# EAGLE design xiao-grove-shield (EAGLE 9.3.1)
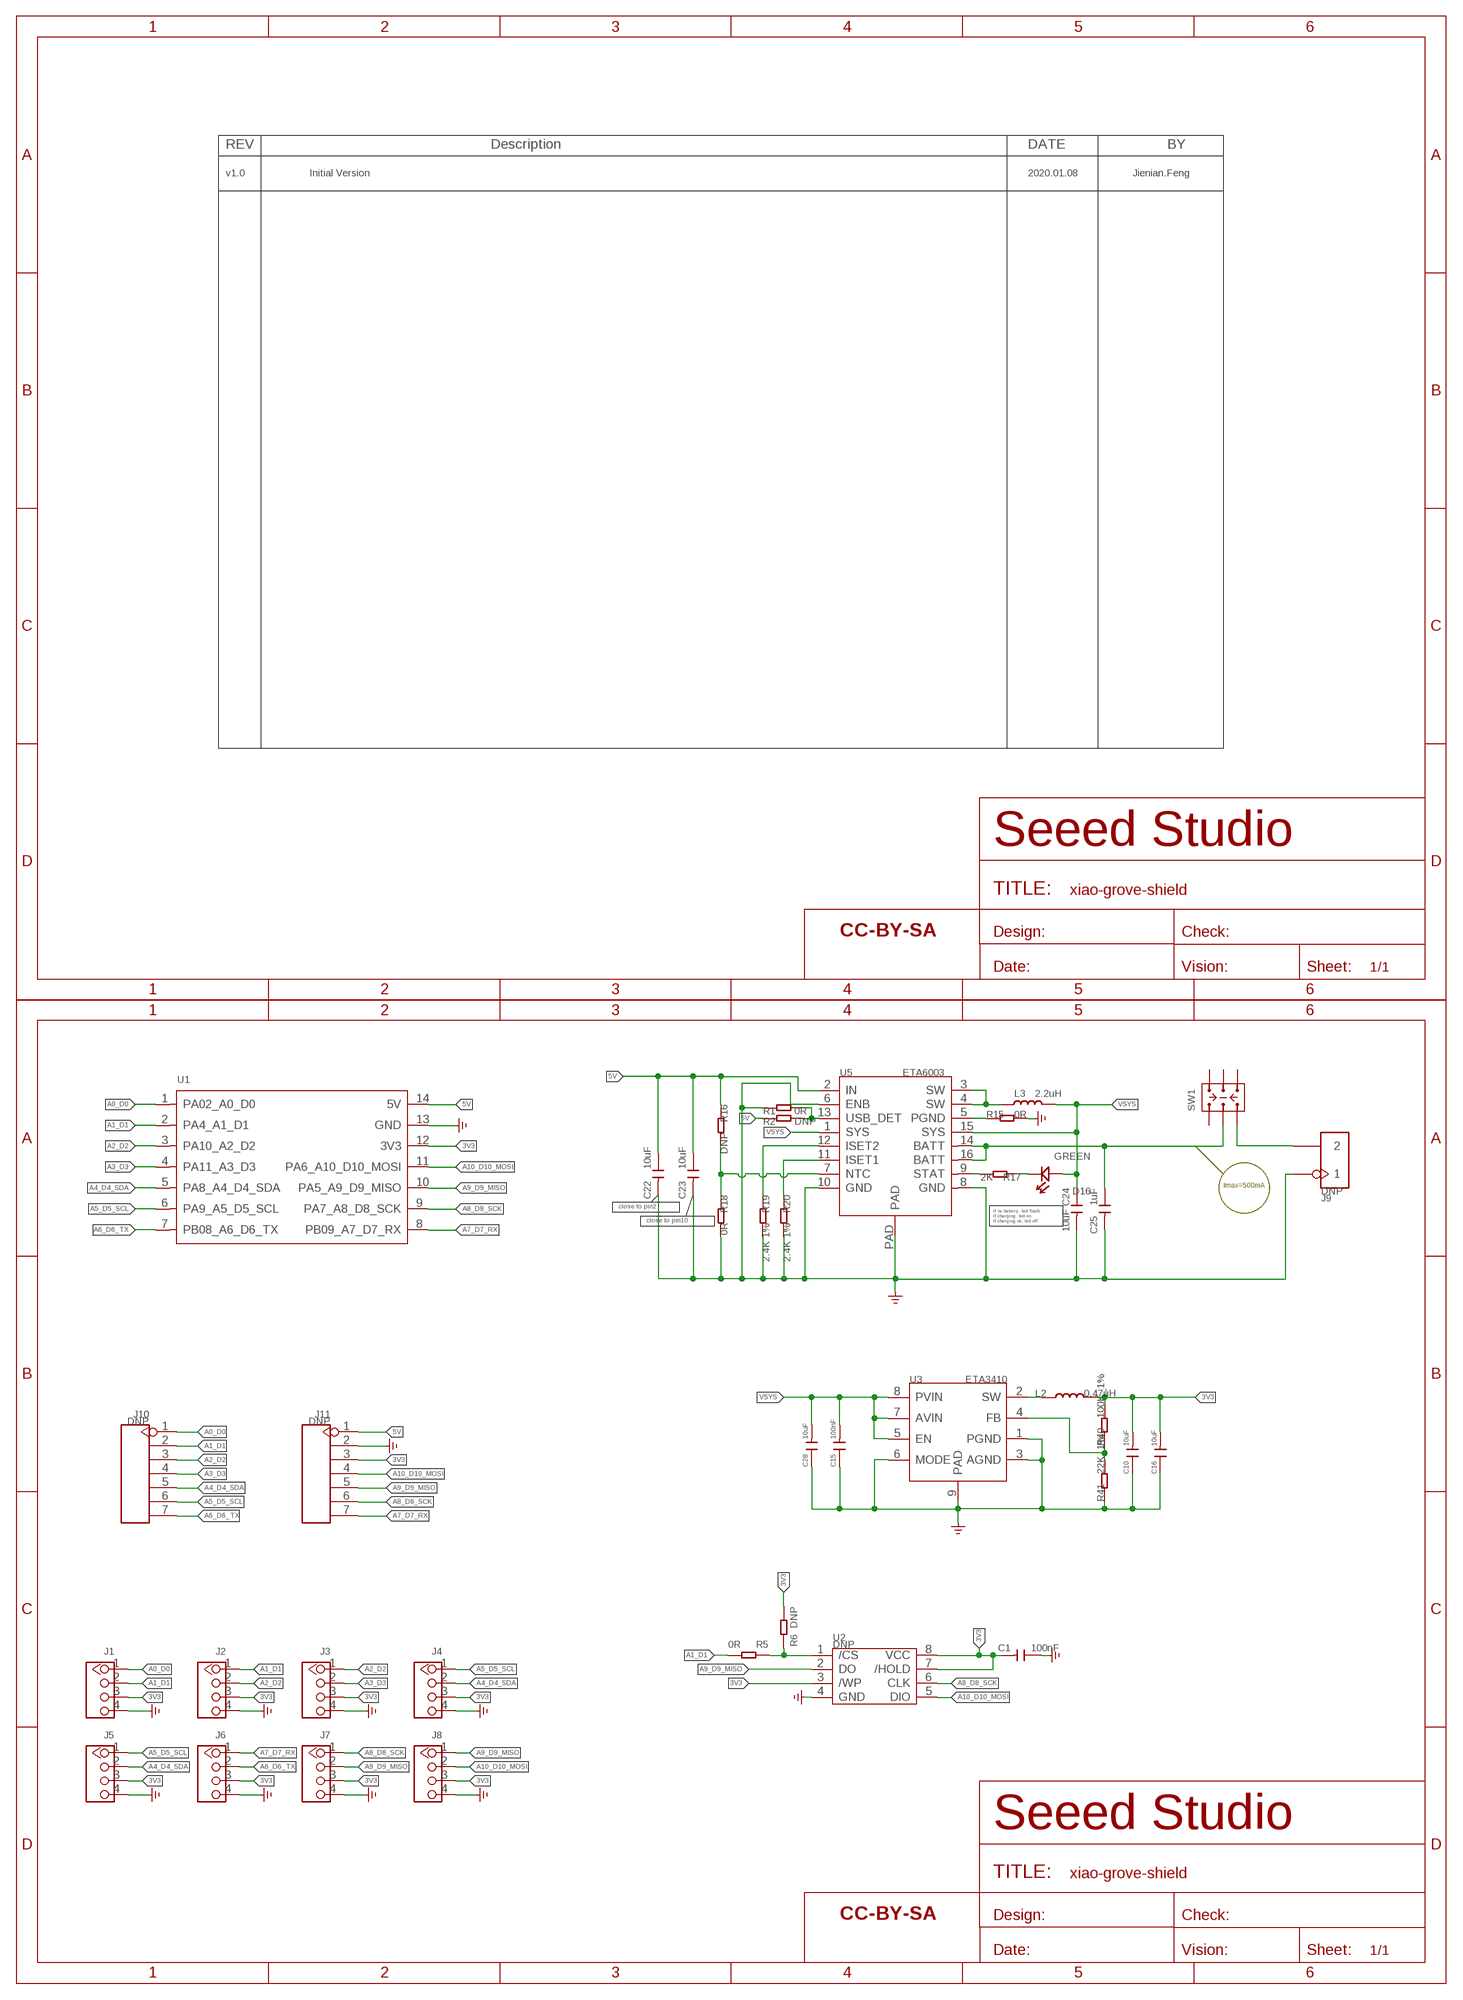
[diagram p0: schematic, sheet 1]

## Parts
C1  100nF  CAP-0402  [C0402]
C10  10uF  CAP-0603  [C0603]
C15  100nF  C-0402  [C0402]
C16  10uF  CAP-0603  [C0603]
C22  10uF  CAP-0603  [C0603]
C23  10uF  CAP-0603  [C0603]
C24  10uF  CAP-0603  [C0603]
C25  1uF  C-0402  [C0402]
C28  10uF  CAP-0603  [C0603]
D16  GREEN  LED-0402  [LED-0402]
FR1  SEEEDSTUDIO-OPEN-SCH-FRAME  [SEEEDSTUDIO-PCB-FRAME]
FR2  SEEEDSTUDIO-OPEN-SCH-FRAME  [SEEEDSTUDIO-PCB-FRAME]
J1  GROVE-CONNECTOR-DIP-320110033  [HW4-2.0]
J2  GROVE-CONNECTOR-DIP-320110033  [HW4-2.0]
J3  GROVE-CONNECTOR-DIP-320110033  [HW4-2.0]
J4  GROVE-CONNECTOR-DIP-320110033  [HW4-2.0]
J5  GROVE-CONNECTOR-DIP-320110033  [HW4-2.0]
J6  GROVE-CONNECTOR-DIP-320110033  [HW4-2.0]
J7  GROVE-CONNECTOR-DIP-320110033  [HW4-2.0]
J8  GROVE-CONNECTOR-DIP-320110033  [HW4-2.0]
J9  DNP  HEADER-2P-50/30MIL  [H2-2.0-C50D30MIL]
J10  DNP  HEADER-7P-2.54  [H7-2.54]
J11  DNP  HEADER-7P-2.54  [H7-2.54]
L2  0.47uH  L-MPM201610SR33_T  [L201610]
L3  2.2uH  INDUCTOR/FERRITE-BEAD'0805'  [L0805]
R1  0R  RES-0402  [R0402]
R2  DNP  RES-0402  [R0402]
R5  0R  RES-0402  [R0402]
R6  DNP  RES-0402  [R0402]
R15  0R  R-0402  [R0402]
R16  DNP  R-0402  [R0402]
R17  2K  R-0402  [R0402]
R18  0R  R-0402  [R0402]
R19  2.4K 1%  R-0402  [R0402]
R20  2.4K 1%  R-0402  [R0402]
R40  100K_1%  R-0402  [R0402]
R41  22K_1%  R-0402  [R0402]
SW1  SWITCH-2CH-6P-311030004  [SW6-2.54-9.0X3.5X3.2MM-90D]
U1  MOUDLE-SEEEDUINO-XIAO-DIP  [MOUDLE14P-2.54-21X17.8MM]
U2  DNP  FLASH-W25X80-SS  [SOIC8-1.27-5.3X5.3MM]
U3  ETA3410  CONVERTER-ETA3410  [DFN8G-0.5-2X2MM]
U5  ETA6003  PMIC-ETA6003-310990023  [QFN16GA-0.5-3X3MM]

## Nets
3V3: C1.2 C10.2 C16.2 J1.3 J2.3 J3.3 J4.3 J5.3 J6.3 J7.3 J8.3 J11.3 L2.2 R6.1 R40.2 U1.12(3V3) U2.3(/WP) U2.7(/HOLD) U2.8(VCC)
5V: C22.1 C23.1 J11.1 R2.1 R16.1 U1.14(5V) U5.2(IN)
A0_D0: J1.1 J10.1 U1.1(PA02_A0_D0)
A1_D1: J1.2 J2.1 J10.2 R5.1 U1.2(PA4_A1_D1)
A2_D2: J2.2 J3.1 J10.3 U1.3(PA10_A2_D2)
A3_D3: J3.2 J10.4 U1.4(PA11_A3_D3)
A4_D4_SDA: J4.2 J5.2 J10.5 U1.5(PA8_A4_D4_SDA)
A5_D5_SCL: J4.1 J5.1 J10.6 U1.6(PA9_A5_D5_SCL)
A6_D6_TX: J6.2 J10.7 U1.7(PB08_A6_D6_TX)
A7_D7_RX: J6.1 J11.7 U1.8(PB09_A7_D7_RX)
A8_D8_SCK: J7.1 J11.6 U1.9(PA7_A8_D8_SCK) U2.6(CLK)
A9_D9_MISO: J7.2 J8.1 J11.5 U1.10(PA5_A9_D9_MISO) U2.2(DO)
A10_D10_MOSI: J8.2 J11.4 U1.11(PA6_A10_D10_MOSI) U2.5(DIO)
GND: C1.1 C10.1 C15.1 C16.1 C22.2 C23.2 C24.2 C25.2 C28.1 J1.4 J2.4 J3.4 J4.4 J5.4 J6.4 J7.4 J8.4 J9.1 J11.2 R1.1 R15.2 R18.2 R19.2 R20.2 R41.1 U1.13(GND) U2.4(GND) U3.1(PGND) U3.3(AGND) U3.6(MODE) U3.9(PAD) U5.6(ENB) U5.8(GND) U5.10(GND) U5.PAD ; supply symbol labelled GND_POWER
N$1: R1.2 R2.2 U5.13(USB_DET)
N$2: J9.2 SW1.CH1B
N$3: R5.2 R6.2 U2.1(/CS)
N$4: C25.1 SW1.COM1 U5.14(BATT) U5.16(BATT)
N$21: R40.1 R41.2 U3.4(FB)
N$26: L3.1 U5.3(SW) U5.4(SW)
N$29: L2.1 U3.2(SW)
N$30: D16.- R17.1
N$31: R17.2 U5.9(STAT)
N$33: R16.2 R18.1 U5.7(NTC)
N$34: R20.1 U5.11(ISET1)
N$36: R19.1 U5.12(ISET2)
N$37: R15.1 U5.5(PGND)
VSYS: C15.2 C24.1 C28.2 D16.+ L3.2 U3.5(EN) U3.7(AVIN) U3.8(PVIN) U5.1(SYS) U5.15(SYS)
Unconnected: SW1.CH1A SW1.CH2A SW1.CH2B SW1.COM2

## Notes on the sheet
- v1.0 | Initial Version | 2020.01.08 | Jienian.Feng
- Imax=500mA
- close to pin2
- close to pin10
- if no battery, led flash.
  if charging, led on.
  if charging ok, led off.

## Library data of the parts
C1 C10 C16 C22-C24 C28 = Discrete-new:CAP: Ceramic Capacitors
C15 C25 = Discrete-small:C*: Ceramic Capacitors
D16 = Discrete-new:LED
FR1 FR2 = moudle-new:SEEEDSTUDIO-OPEN-SCH-FRAME
J1-J8 = Connector-new:GROVE-CONNECTOR-DIP
J9 = Connector-new:HEADER-2P
J10 J11 = Connector-new:HEADER-7P
L2 = Discrete-new:L
L3 = Discrete-new:INDUCTOR/FERRITE-BEAD
R1 R2 R5 R6 = Discrete-new:RES
R15-R20 R40 R41 = Discrete-small:R*
SW1 = Switch:SWITCH-2CH-6P
U1 = moudle-new:MOUDLE-SEEEDUINO-XIAO
U2 = IC-new:FLASH-W25X80: 1M-BIT,2M-BIT,4M-BIT AND 8M-BIT SERIAL FLASH MEMORY WITH 4KB SECTORS AND DUAL OUTPUT SPI
U3 = IC-new:CONVERTER-ETA3410: 3MHZ 2A High Step-Down Converter in DFN2x2-8L Package
U5 = IC-new:PMIC-ETA6003

## Board
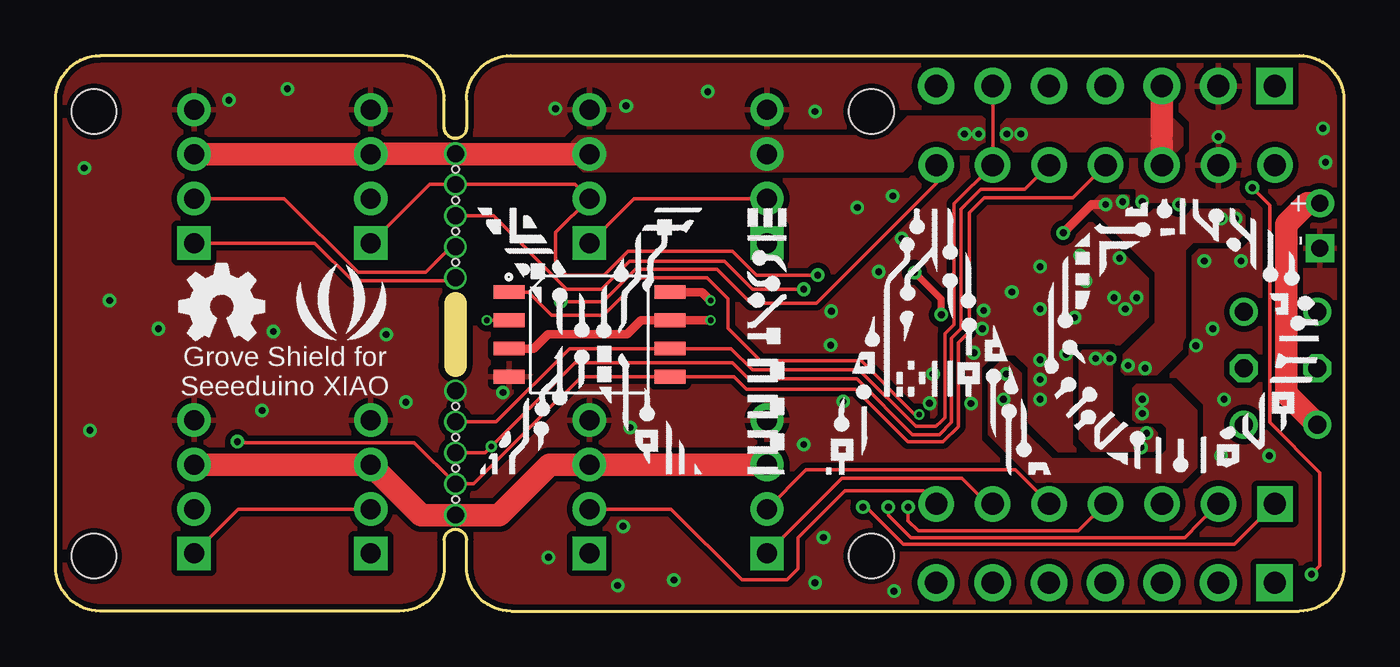
[diagram p1: board, top side]
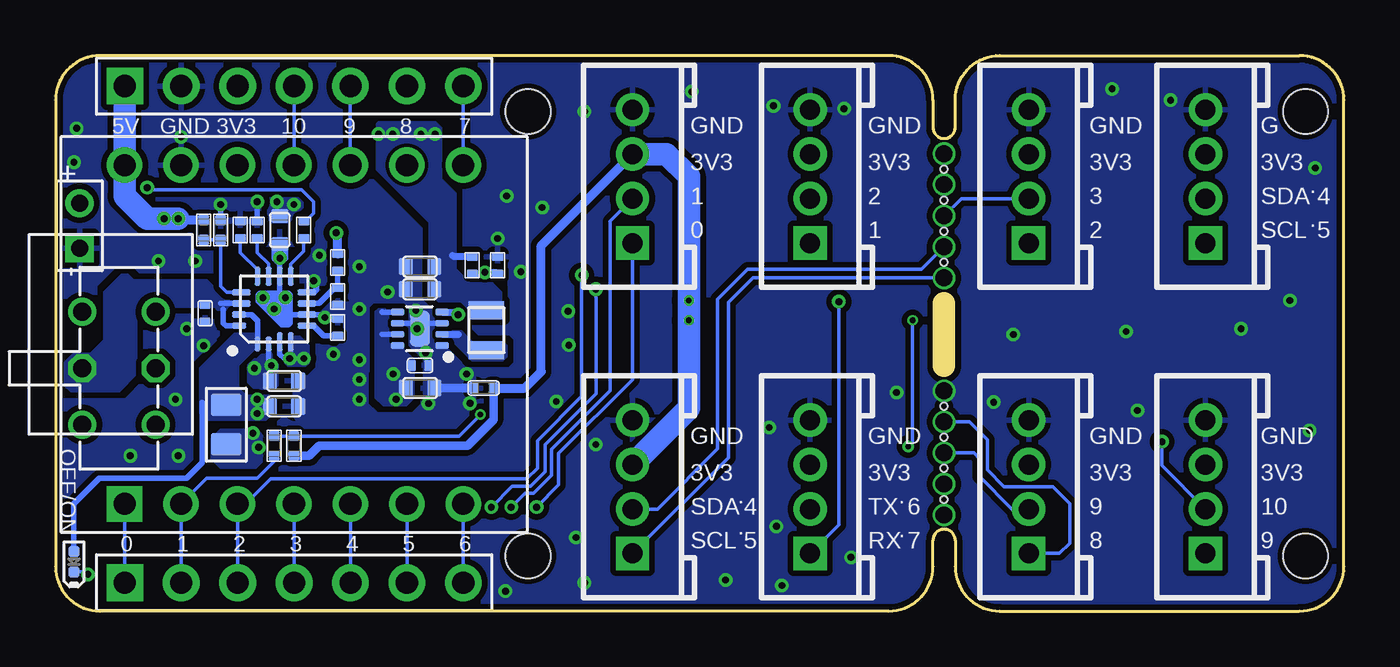
[diagram p2: board, bottom side, seen from below]

Size 58 x 25 mm. Coordinates in mm from the lower left corner, seen from the top.
Outline: 18,13.85 18,11.04
Outline: 18.5,2 18.5,3.19 arc180 17.5,3.19 17.5,2 arc-90 15.5,0 2,0 arc-90 0,2 0,23 arc-90 2,25 15.5,25 arc-90 17.5,23 17.5,21.77 arc180 18.5,21.77 18.5,23 arc-90 20.5,25 56,25 arc-90 58,23 58,2 arc-90 56,0 20.5,0 arc-90 18.5,2
Copper layers (1*16): Top 0.035mm / dielectric 1.5mm / Bottom 0.035mm
Design rules "SeeedStudio_2layer_DRU_no_angle_20140221 *": minimum track width 1mil, minimum drill 10mil, track to track 6mil, track to pad 6mil, pad to pad 6mil, via to via 6mil, smd to smd 0mil, copper to edge 10mil, drill to drill 10mil, minimum pad ring 2mil, minimum via ring 2mil, stop-mask expansion 2mil, vias tented up to drill 25mil, thermal gap 10mil
Holes 2 mm at 1.73,22.48 1.73,2.49 36.73,22.48 36.73,2.49
Holes 0.3 mm at 18,19.88 18,18.48 18,17.09 18,15.69 18,9.21 18,7.82 18,6.42 18,5.02
bRestrict: area 36,12.6 to 36.1,13.2

### Footprints (pad centres in the part's own frame; a part is rotated, then mirrored left to right if it is on the bottom)
C0402 = smd 0.445 x 0.508: 1 -0.445,0; 2 0.445,0
C0603 = smd 0.635 x 0.762: 1 -0.635,0; 2 0.635,0
C0402' = smd 0.385 x 0.508: 1 0.383,0; 2 -0.383,0
LED-0402 = smd 0.5 x 0.5: + 0.463,0; - -0.463,0
HW4-2.0 = drill 0.9 pad 1.5 square: 1 -3,0 | drill 0.9 pad 1.5: 2 -1,0; 3 1,0; 4 3,0
H2-2.0-C50D30MIL = drill 0.762 pad 1.27 square: 1 -1.016,0 | drill 0.762 pad 1.27: 2 1.016,0
H7-2.54 = drill 1 pad 1.651 square: 1 0,7.62 | drill 1 pad 1.651: 2 0,5.08; 3 0,2.54; 4 0,0; 5 0,-2.54; 6 0,-5.08; 7 0,-7.62
L201610 = smd 0.8 x 1.6: 1 -0.9,0; 2 0.9,0
L0805 = smd 1.016 x 1.397: 1 -0.889,0; 2 0.889,0
R0402 = smd 0.445 x 0.508: 1 -0.445,0; 2 0.445,0
R0402' = smd 0.385 x 0.508: 1 0.383,0; 2 -0.383,0
SW6-2.54-9.0X3.5X3.2MM-90D = drill 0.813 pad 1.27: CH1A -2.54,-1.65; CH1B 2.54,-1.65; CH2A -2.54,1.65; CH2B 2.54,1.65 | drill 0.813 pad 1.27 octagon: COM1 0,-1.65; COM2 0,1.65
MOUDLE14P-2.54-21X17.8MM = drill 1 pad 1.6 square: 1 7.62,7.62 | drill 1 pad 1.6: 2 5.08,7.62; 3 2.54,7.62; 4 0,7.62; 5 -2.54,7.62; 6 -5.08,7.62; 7 -7.62,7.62; 8 -7.62,-7.62; 9 -5.08,-7.62; 10 -2.54,-7.62; 11 0,-7.62; 12 2.54,-7.62; 13 5.08,-7.62; 14 7.62,-7.62
SOIC8-1.27-5.3X5.3MM = smd 0.62 x 1.4: 1 -1.905,-3.623; 2 -0.635,-3.623; 3 0.635,-3.623; 4 1.905,-3.623; 5 1.905,3.623; 6 0.635,3.623; 7 -0.635,3.623; 8 -1.905,3.623
DFN8G-0.5-2X2MM = smd 0.3 x 0.6: 1 -0.75,-1; 2 -0.25,-1; 3 0.25,-1; 4 0.75,-1; 5 0.75,1; 6 0.25,1; 7 -0.25,1; 8 -0.75,1 | smd 1.6 x 0.9: 9 0,0
QFN16GA-0.5-3X3MM = smd 0.28 x 0.65: 1 -0.75,-1.575; 2 -0.25,-1.575 | smd 0.28 x 0.85: 3 0.25,-1.475; 4 0.75,-1.475; 9 0.75,1.475; 10 0.25,1.475; 11 -0.25,1.475; 12 -0.75,1.475 | smd 0.85 x 0.28: 5 1.475,-0.75; 6 1.475,-0.25; 7 1.475,0.25; 8 1.475,0.75; 13 -1.475,0.75; 14 -1.475,0.25 | smd 0.65 x 0.28: 15 -1.575,-0.25; 16 -1.575,-0.75 | smd 0.508 x 0.508: PAD 0,0

### Placement (x,y rotation side)
C1  38.73,10.04 0 bottom
C10  41.59,14.48 0 bottom
C15  100nF  [C0402']  41.59,11.05 0 bottom
C16  41.59,15.5 0 bottom
C22  47.71,10.36 0 bottom
C23  47.9,17.15 270 bottom
C24  47.71,9.21 0 bottom
C25  1uF  [C0402']  51.27,13.4 90 bottom
C28  41.59,10.04 180 bottom
D16  57.17,2.23 90 bottom
FR1  55.27,-13.84 0 bottom  (outside the outline)
FR2  55.9,-20.19 0 bottom  (outside the outline)
J1  32.03,19.56 90 bottom
J2  24.03,19.56 90 bottom
J3  14.19,19.56 90 bottom
J4  6.23,19.56 90 bottom
J5  32.03,5.59 90 bottom
J6  24.03,5.59 90 bottom
J7  14.19,5.59 90 bottom
J8  6.23,5.59 90 bottom
J9  56.92,17.34 90 bottom
J10  47.26,1.28 90 bottom
J11  47.26,23.63 90 bottom
L2  38.61,12.64 90 bottom
L3  50.32,8.39 90 bottom
R1  50.57,17.15 270 bottom
R2  51.33,17.15 270 bottom
R5  48.16,7.44 90 bottom
R6  47.27,7.44 90 bottom
R15  0R  [R0402']  45.3,12.77 270 bottom
R16  DNP  [R0402']  45.3,15.69 90 bottom
R17  2K  [R0402']  46.82,17.15 90 bottom
R18  0R  [R0402']  45.3,14.17 90 bottom
R19  2.4K 1%  [R0402']  49.68,17.15 270 bottom
R20  2.4K 1%  [R0402']  48.92,17.15 270 bottom
R40  100K_1%  [R0402']  39.24,15.56 270 bottom
R41  22K_1%  [R0402']  38.1,15.56 90 bottom
SW1  55.14,10.93 270 bottom
U1  47.27,12.45 180 bottom
U2  24.03,12.45 270 top
U3  41.59,12.71 90 bottom
U5  48.16,13.6 0 bottom

### Tracks (layer width: path | path; a pad name or v marks a point on that pad's centre or on a via)
3V3  (via drill 0.25 pad 0.46, 0.3 pad 0.61, 0.76 pad 1.02)
  Top 0.381: U2.3 21.53,11.82 22.16,12.45 25.72,12.45 26.35,13.09 U2.7 v29.49,13.09 | U2.8 29.11,14.36 v29.49,13.98
  Top 1.016: U1.12 49.81,21.09 | J5.3 J6.3 22.24,6.59 19.97,4.32 v18,4.32 16.46,4.32 J7.3 | J4.3 J3.3 14.21,20.58 v18,20.58 18.02,20.56 J2.3 | 14.21,6.61 J7.3 | J7.3 J8.3 | 49.81,21.47 J11.3
  Bottom 0.305: 40.13,16.01 40.07,15.95 R40.2
  Bottom 0.381: R6.1 46.58,6.99 46.13,7.45 39.46,7.45 38.76,8.15 | 38.76,8.15 38.29,8.62 C1.2 | 38.76,8.15
  Bottom 0.406: J1.3 36.14,16.45 36.14,10.78 36.88,10.04 C1.2
  Bottom 1.016: J1.3 30.49,20.56 29.49,19.56 v29.49,13.98 v29.49,13.09 29.49,9.13 J5.3
  other vias: 43.46,21.47 42.82,21.47 41.55,21.47 40.92,21.47
  pour Bottom (isolate 0.152, no thermals): 38.23,13.21 38.99,13.21 39.75,13.98 40.77,13.98 41.15,14.36 41.15,17.51 43.51,19.87 43.51,21.93 43.46,21.98 40.92,21.98 40.66,21.72 40.66,19.44 40,18.78 40,15.37 39.37,14.74 38.35,14.74 37.97,14.36 37.97,13.47
  pour Top (isolate 0.254, no thermals): 42.82,22.1 50.32,22.1 50.7,21.72 50.7,20.96 50.44,20.71 42.82,20.71 42.57,20.96 42.57,21.85
  pour Top (isolate 0.254, no thermals): 41.68,22.23 38.38,22.23 37.49,21.34 23.52,21.34 23.27,21.09 23.27,20.33 23.78,19.82 38.12,19.82 39.14,20.83 41.55,20.83 41.81,21.09 41.81,22.1
5V  (via drill 0.3 pad 0.61)
  Top 0.406: v47.27,18.29 46.63,18.29 v45.36,17.02
  Bottom 0.254: U5.2 48.41,11.18 v48.28,11.05
  Bottom 0.406: R2.1 52.41,17.59 v52.48,17.66 | R16.1 45.3,16.96 v45.36,17.02
  Bottom 1.016: v52.48,17.66 v53.11,17.66 53.87,17.66 54.89,18.67 U1.14 J11.1
  other vias: 49.05,10.93 48.03,18.42
  pour Bottom (isolate 0.152, no thermals): 48.28,11.56 48.28,11.31 48.03,11.05 48.03,10.17 48.16,10.04 49.05,10.04 49.3,10.29 49.3,11.05 49.05,11.31 48.92,11.31 48.67,11.56
  pour Top (isolate 0.254, no thermals): 48.03,10.8 48.03,11.44 49.55,12.96 49.55,15.25 46.76,18.04 46.76,18.42 47.01,18.67 48.28,18.67 48.92,18.04 53.24,18.04 53.49,17.79 53.49,17.02 53.11,16.64 51.21,16.64 50.82,16.26 50.82,11.94 49.55,10.67 48.16,10.67
  pour Bottom (isolate 0.254, no thermals): 48.16,18.8 47.14,18.8 46.89,18.55 46.89,18.17 47.52,17.53 48.28,17.53 48.41,17.66 48.41,18.55
A0_D0  (via drill 0.3 pad 0.61)
  Top 0.152: v36.35,4.68 36.5,4.68 38.18,3 53.06,3 U1.1
  Bottom 0.152: J1.1 32.03,10.42 35.35,7.1 35.35,5.68 v36.35,4.68 | J10.1 U1.1
A1_D1  (via drill 0.3 pad 0.61)
  Top 0.152: 39.52,3.31 50.83,3.31 51.54,4.02 | 39.52,3.31 | 39.39,3.31 39.52,3.31 | 39.52,3.31 38.51,3.31 37.49,4.32 v37.49,4.68 | J1.2 26.03,18.56 J2.1 | 51.54,4.02 U1.2 | 51.54,4.02
  Bottom 0.152: R5.1 48.16,6.74 48.92,5.97 51.2,5.97 U1.2 J10.2 | J1.2 33.04,17.55 33.04,9.91 35.67,7.29 35.67,6.12 36.47,5.31 36.85,5.31 v37.49,4.68
A2_D2  (via drill 0.3 pad 0.61, 0.76 pad 1.02)
  Top 0.152: v34.31,15.12 31.56,15.12 30.48,16.2 25.78,16.2 24.7,15.12 23.01,15.12 22.51,15.63 22.51,17.04 J2.2 23.4,19.2 v18,19.2 16.83,19.2 J3.1
  Bottom 0.152: v34.31,15.12 34.31,9.66 36.3,7.67 36.3,6.44 36.79,5.95 48.31,5.95 49.43,4.83 U1.3 J10.3
A3_D3  (via drill 0.3 pad 0.61, 0.76 pad 1.02)
  Top 0.152: 38.38,4.71 v38.38,4.68 38.38,4.07 38.84,3.61 46.05,3.61 U1.4 | v18,17.79 19.71,17.79 23.01,14.48 24.57,14.48 25.84,15.75 30.11,15.75 31.38,14.48 v33.68,14.48
  Bottom 0.152: v33.68,14.48 33.68,9.79 35.97,7.49 35.97,6.26 36.61,5.62 37.44,5.62 v38.38,4.68 | v18,17.79 17.23,18.56 J3.2 | J10.4 U1.4
A4_D4_SDA  (via drill 0.76 pad 1.02)
  Top 0.152: J5.2 33.79,6.36 43.2,6.36 U1.5 | v18,16.39 17.8,16.39 16.66,15.25 13.62,15.25 10.3,18.56 J4.2
  Bottom 0.152: J10.5 U1.5 | J5.2 30.91,4.59 28.19,7.31 28.19,14.04 26.86,15.37 19.02,15.37 v18,16.39
A5_D5_SCL  (via drill 0.76 pad 1.02)
  Top 0.152: J5.1 35.41,5.97 40.79,5.97 41.94,4.83 U1.6 | J4.1 11.66,16.56 13.36,14.87 17.88,14.87 v18,14.99
  Bottom 0.152: J5.1 27.71,6.91 27.71,13.89 26.61,14.99 v18,14.99 | J10.6 U1.6
A6_D6_TX
  Top 0.152: J6.2 27.71,4.59 30.9,1.4 32.92,1.4 33.43,1.91 33.43,3.31 35.53,5.42 39.06,5.42 U1.7
  Bottom 0.152: U1.7 39.65,1.28 J10.7
A7_D7_RX  (via drill 0.3 pad 0.61)
  Top 0.152: U1.8 39.65,19.25 34.25,13.85 32.55,13.85 | v22.74,13.92 24.63,13.92 24.64,13.91 26.1,15.37 29.78,15.37 31.31,13.85 32.55,13.85 | 32.55,13.85
  Bottom 0.152: J6.1 22.74,3.89 v22.74,13.92 | U1.8 39.65,23.63 J11.7
A8_D8_SCK  (via drill 0.76 pad 1.02)
  Top 0.152: v18,8.52 19.39,8.52 19.84,8.52 23.14,11.82 U2.6 30.42,11.82 31.37,10.86 36.17,10.86 38.72,8.31 39.64,8.31 39.88,8.55 | J11.6 42.19,23.62 U1.9 40.45,18.33 40.45,12.9 40.03,12.48 40.03,8.71 39.88,8.55 | 39.88,8.55
  Bottom 0.152: J7.1 12.8,2.59 12.34,3.05 12.34,4.83 13.11,5.59 15.3,5.59 16.06,6.35 16.06,7.7 16.87,8.52 v18,8.52
A9_D9_MISO  (via drill 0.25 pad 0.46, 0.25 pad 0.51, 0.76 pad 1.02)
  Top 0.152: J8.1 8.23,4.59 J7.2 | U1.10 43.64,18.98 41.66,18.98 40.77,18.09 40.77,12.71 40.33,12.27 40.33,8.49 39.79,7.94 38.58,7.94 36.08,10.45 31.2,10.45 30.47,11.18 23.4,11.18 v19.62,7.4 19.34,7.12 v18.01,7.12 v18,7.12 | v19.42,13.09 U2.2
  Bottom 0.152: v18,7.12 16.66,7.12 16.41,6.86 16.41,6.06 14.94,4.59 J7.2 | U1.10 44.73,23.62 J11.5 | v19.62,7.4 19.42,7.6 v19.42,13.09
A10_D10_MOSI  (via drill 0.3 pad 0.61, 0.76 pad 1.02)
  Top 0.152: v8.19,7.63 8.24,7.57 16.15,7.57 v18,5.72 18.82,5.72 22.76,9.66 22.8,9.66 23.69,10.55 U2.5 30.54,10.55 31.1,9.99 36,9.99 38.38,7.61 39.96,7.61 40.65,8.31 40.65,12.08 41.13,12.56 41.13,17.92 41.8,18.6 45.8,18.6 U1.11
  Bottom 0.152: U1.11 J11.4 | J8.2 8.19,6.55 v8.19,7.63
GND  (via drill 0.3 pad 0.61, 0.76 pad 1.02)
  Bottom 0.254: 47.91,15.63 U5.10 47.91,13.6 U5.PAD 47.91,13.35 U5.6 46,13.35 v45.87,13.21 45.81,13.15 R15.2 | v47.91,15.88 C23.2 | v47.91,15.88 47.91,15.63 | 47.91,15.63 48.16,15.88 48.16,16.26 | 47.91,15.63 47.65,15.88 47.65,16.52 | R20.2 v48.92,18.42 | R1.1 v50.57,18.29 | U5.8 46.39,14.35 46.25,14.48 46.25,14.74 v46.38,14.87 | U3.6 41.72,12.96 v41.72,12.71 | v47.9,15.88 v47.91,15.88 | v47.91,15.88 48.03,15.88 | U3.3 41.4,12.96
  Bottom 0.406: C1.1 C28.1
  other vias: 18,9.91 45.49,11.56 44.32,9.53 44.32,10.42 44.32,11.31 48.16,13.6 47.65,14.1 48.67,14.1 46.13,16.01 44.32,13.6 44.32,15.5 41.78,13.53 41.34,11.63 41.21,9.34 39.34,9.35 43.05,14.36 38.1,16.77 52.09,12.71 51.33,11.94 52.35,21.34 57.05,21.72 57.17,20.2 36.09,18.17 37.69,18.67 35.46,9.43 34.92,13.49 20.14,9.84 34.9,11.97 51.71,15.75 53.36,15.75 37.06,15.27 39.5,10.67 33.68,7.5 34.19,22.48 29.36,23.37 25.68,22.74 22.51,22.61 25.3,1.15 34.19,1.28 34.57,3.31 22.19,2.42 25.87,8.26 14.88,12.45 9.8,12.58 4.63,12.71 2.44,13.98 1.29,19.95 1.55,8.13 9.3,9.02 15.77,9.4 52.6,9.53 54.63,6.99 52.48,6.99 37.74,0.89 27.84,1.4 25.55,3.82 7.81,22.99 10.44,23.5
  pour Bottom (isolate 0.152, no thermals): 47.14,10.55 46.63,10.55 44.98,12.2 44.98,12.96 45.11,13.09 45.87,13.09 46,13.21 46,13.47 45.62,13.85 44.69,13.85 44.69,16.39 41.78,16.39 41.57,16.19 41.57,14.03 41.01,13.47 41.03,11.97 40.55,11.97 39.76,11.18 39.76,9.33 40.07,9.02 41.4,9.02 41.4,11.33 42.03,11.97 42.03,13.68 42.28,13.93 43.7,13.93 43.94,13.69 43.94,10.8 44.7,10.04 46,10.04 46,9.02 46.38,8.64 47.14,8.64 47.27,8.77 47.27,10.42
  pour Bottom (isolate 0.254, rank 6): 58.06,25.02 -0.1,25.02 -0.1,0.01 58.06,0.01
  pour Top (isolate 0.254, rank 6): 58.06,25.02 -0.1,25.02 -0.1,0.01 55.02,0.01 55.02,-0.76 58.06,-0.76
  pour Bottom (isolate 0.254, no thermals): 51.08,13.09 52.09,13.09 52.35,12.83 52.35,12.07 51.97,11.69 51.33,11.69 50.82,12.2 50.82,12.83
N$1
  Bottom 0.152: U5.13 50.3,14.35 50.57,14.61 R1.2 R2.2
N$2
  Top 1.016: J9.2 56.35,18.36 55.4,17.41 55.4,9.78 SW1.CH1B
N$3  (via drill 0.25 pad 0.46)
  Top 0.152: U2.1 21.3,14.36 22.34,13.32 24.68,13.32 26.35,14.99 29.32,14.99 30.09,14.23 | v38.87,8.85 38.7,8.85 36.28,11.26 31.74,11.26 30.26,12.73 30.26,14.05 30.09,14.23 | 30.09,14.23
  Bottom 0.152: R5.2 R6.2 40.53,7.88 39.84,7.88 v38.87,8.85
N$4
  Bottom 0.254: U5.16 50.33,12.85 50.44,12.96 50.44,13.6 | U5.14 50.57,13.85
  pour Bottom (isolate 0.254, no thermals): 50.19,14.1 50.44,14.1 51.21,14.87 54.51,14.87 54.76,15.12 55.02,15.12 55.78,14.36 55.78,12.2 56.41,11.56 57.17,11.56 57.56,11.18 57.56,10.17 57.3,9.91 55.14,9.91 54.38,10.67 54.38,13.72 50.82,13.72 50.7,13.6 50.19,13.6 50.06,13.72 50.06,13.98
N$21  (via drill 0.3 pad 0.61)
  Top 0.305: v38.67,15.25 39.88,14.04 v39.88,13.34
  Bottom 0.305: 38.61,15.25 v38.67,15.25 v38.67,15.24 | 38.61,15.25 38.16,15.25 R41.2 | U3.4 39.99,13.46 v39.88,13.34 | R40.1 38.67,15.18 38.61,15.25
N$26  (via drill 0.3 pad 0.61)
  Bottom 0.254: U5.3 47.91,11.57 47.71,11.37 v47.46,11.37 47.41,11.42 U5.4
  other vias: 46.82,11.37 49.11,8.01 48.86,7.37
  pour Bottom (isolate 0.152, no thermals): 47.4,12.32 47.01,12.32 46.63,11.94 46.63,11.18 46.76,11.05 47.52,11.05 47.65,11.18 47.65,11.44 47.4,11.69
  pour Bottom (isolate 0.254, no thermals): 50.57,8.13 48.92,8.13 48.7,7.88 48.58,7.75 48.58,6.86 48.92,6.52 48.92,6.48 50.57,6.48 50.95,6.86 50.95,7.75
  pour Top (isolate 0.152, no thermals): 49.36,8.2 48.09,8.2 47.52,8.77 47.52,11.56 47.4,11.69 46.25,11.69 46.13,11.56 46.13,7.75 46.63,7.24 49.43,7.24 49.55,7.37 49.55,8.01
N$29
  Bottom 0.305: U3.2 39.88,12.46 39.88,12.45
  pour Bottom (isolate 0.254, no thermals): 40.13,12.58 39.75,12.58 39.24,12.07 37.85,12.07 37.72,11.94 37.72,11.46 37.87,11.31 39.24,11.31 40.26,12.32 40.26,12.45
N$30  (via drill 0.3 pad 0.61)
  Top 0.152: v56.54,1.66 56.92,2.04 56.92,6.23 54.66,8.49 54.66,18.27 v53.87,19.06
  Bottom 0.152: R17.1 46.76,17.53 46.38,17.91 46.38,18.42 46.91,18.95 53.77,18.95 v53.87,19.06 | v56.54,1.66 56.65,1.77 D16.-
N$31
  Bottom 0.152: U5.9 47.41,15.62 46.82,16.2 R17.2
N$33
  Bottom 0.254: U5.7 46.13,13.85 45.43,14.55 R18.1 R16.2
N$34
  Bottom 0.152: U5.11 48.41,15.62 48.92,16.13 R20.1
N$36
  Bottom 0.152: U5.12 48.91,15.36 49.68,16.13 R19.1
N$37
  Bottom 0.254: U5.5 46.39,12.85 45.93,12.39 R15.1
VSYS  (via drill 0.3 pad 0.61)
  Bottom 0.254: U5.15 49.18,13.35 48.91,13.08 U5.1 | U3.7 43.3,12.46 43.31,12.45 | U3.5 43.29,13.46 43.31,13.47 | D16.+ 57.17,4.83 56.03,5.97 52.09,5.97 51.4,6.67 51.4,9.4
  other vias: 42.8,10.67 48.92,9.53 48.92,8.9 42.67,9.53
  pour Bottom (isolate 0.152, no thermals): 49.05,12.45 49.94,12.45 51.46,10.93 51.46,8.9 51.21,8.64 48.54,8.64 48.16,9.02 48.16,9.4 48.41,9.66 49.43,9.66 49.81,10.04 49.81,11.05 48.92,11.94 48.92,12.32
  pour Top (isolate 0.152): 42.04,7.96 42.04,10.67 42.54,11.18 42.93,11.18 43.43,10.67 43.43,8.21 44.84,6.8 49.62,6.8 50.06,7.24 50.06,8.26 49.81,8.52 48.67,8.52 48.54,8.64 48.54,10.04 48.67,10.17 50.19,10.17 51.33,9.02 51.33,6.48 50.7,5.85 44.14,5.85
  pour Bottom (isolate 0.152, no thermals): 43.05,13.47 43.05,12.07 42.93,11.94 42.54,11.94 41.91,11.31 41.91,9.6 42.23,9.28 43.23,9.28 43.56,9.61 43.56,13.47 43.46,13.57 43.15,13.57

### Text on the board
tNames: + | - | Grove Shield for / Seeeduino XIAO
bNames: G | GND | GND | GND | 7 | 8 | 9 | 10 | 3V3 | GND | 5V | 3V3 | 3V3 | 3V3 | 3V3 | + | 4 | · | SDA | 3 | 2 | 1 | 5 | · | SCL | 2 | 1 | 0 | - | GND | GND | GND | GND | OFF/ON | 3V3 | 3V3 | 3V3 | 3V3 | 10 | 9 | 6 | · | TX | 4 | · | SDA | · | 9 | 8 | 7 | · | RX | 5 | SCL | 6 | 5 | 4 | 3 | 2 | 1 | 0